# Altium schematic sheet TX_FlexiConnectors.SchDoc: Laser PCB
size A3; DrawnBy: James Singleton; Organization: TMC Technology Ltd.; DocumentNumber: 9; Revision: A; SheetNumber: 13; SheetTotal: 18; Drawn Date: 22/12/2020
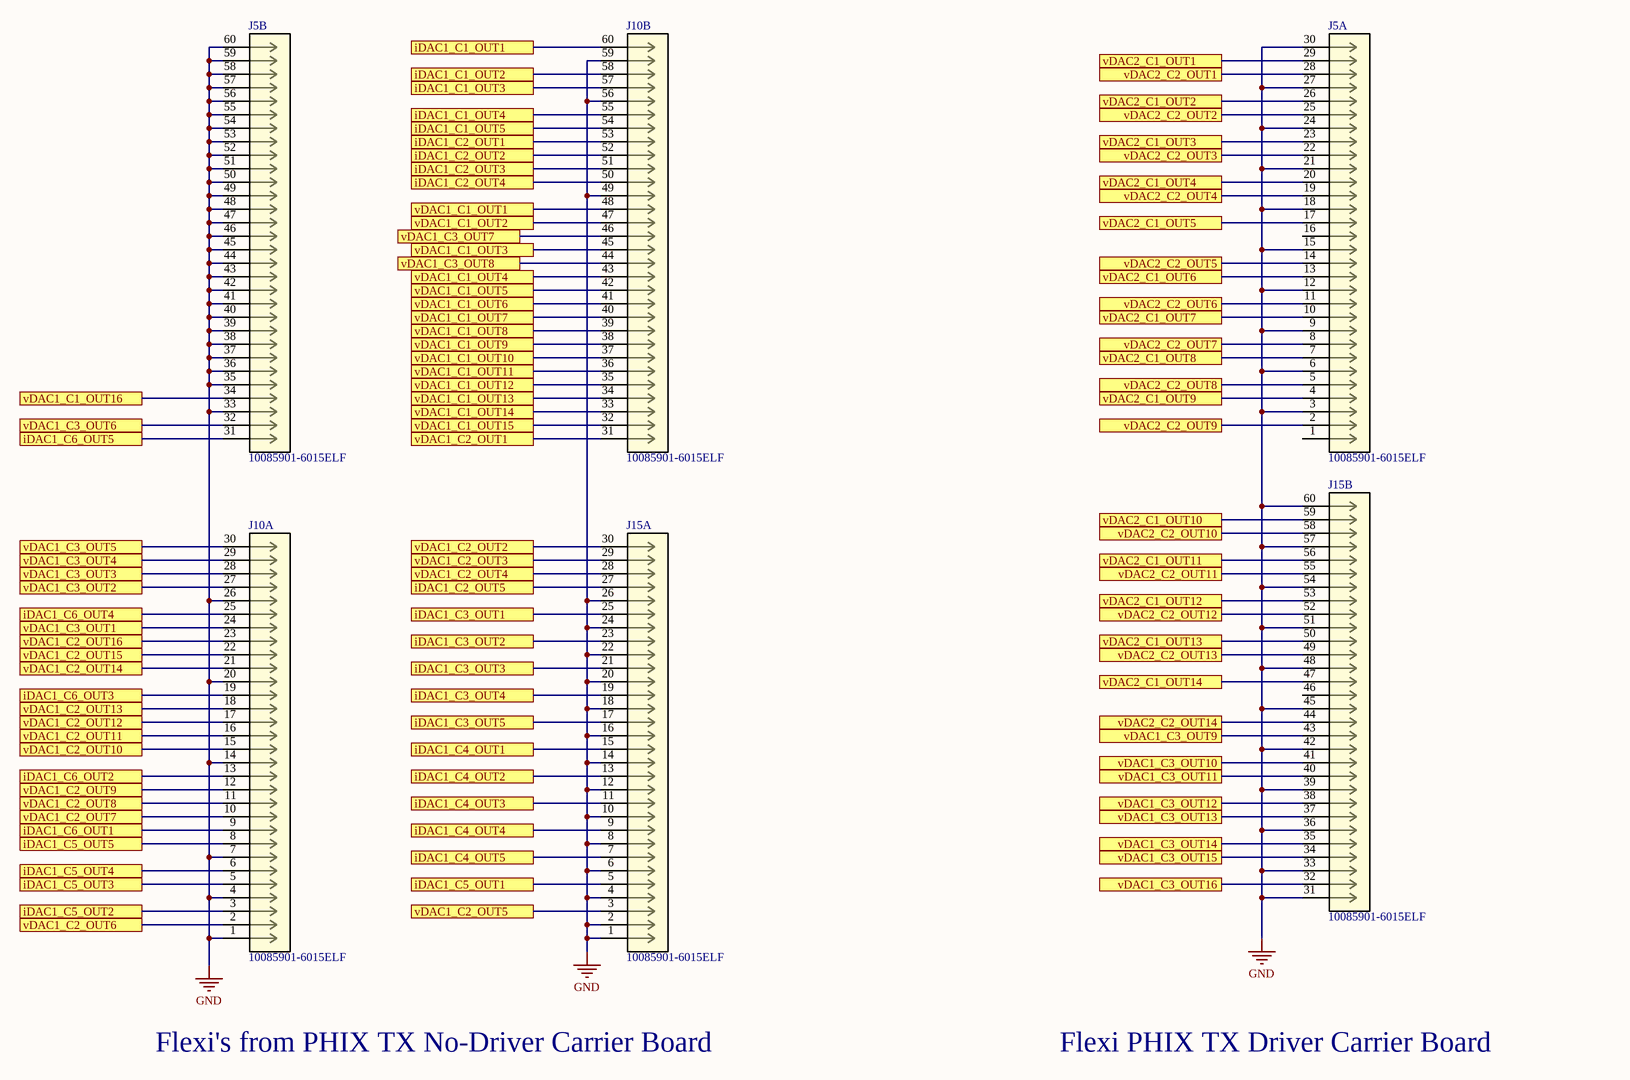
[diagram p0: TX_FlexiConnectors.SchDoc]

## Parts
J5  10085901-6015ELF  [CONN_10085901-6015ELF_AMP]  (parts A,B of 2)
J10  10085901-6015ELF  [CONN_10085901-6015ELF_AMP]  (parts A,B of 2)
J15  10085901-6015ELF  [CONN_10085901-6015ELF_AMP]  (parts A,B of 2)

## Ports
iDAC1_C1_OUT1 (see iDAC1[4A]), iDAC1_C1_OUT2 (see iDAC1[4A]), iDAC1_C1_OUT3 (see iDAC1[4A]), iDAC1_C1_OUT4 (see iDAC1[4A]), iDAC1_C1_OUT5 (see iDAC1[4A]), iDAC1_C2_OUT1 (see iDAC1[4A]), iDAC1_C2_OUT2 (see iDAC1[4A]), iDAC1_C2_OUT3 (see iDAC1[4A]), iDAC1_C2_OUT4 (see iDAC1[4A]), iDAC1_C2_OUT5 (see iDAC1[4A]), iDAC1_C3_OUT1 (see iDAC1[4B]), iDAC1_C3_OUT2 (see iDAC1[4B]), iDAC1_C3_OUT3 (see iDAC1[4B]), iDAC1_C3_OUT4 (see iDAC1[4B]), iDAC1_C3_OUT5 (see iDAC1[4B]), iDAC1_C4_OUT1 (see iDAC1[4B]), iDAC1_C4_OUT2 (see iDAC1[4B]), iDAC1_C4_OUT3 (see iDAC1[4B]), iDAC1_C4_OUT4 (see iDAC1[4B]), iDAC1_C4_OUT5 (see iDAC1[4B]), iDAC1_C5_OUT1 (see iDAC1[4C]), iDAC1_C5_OUT2 (see iDAC1[4C]), iDAC1_C5_OUT3 (see iDAC1[4C]), iDAC1_C5_OUT4 (see iDAC1[4C]), iDAC1_C5_OUT5 (see iDAC1[4C]), iDAC1_C6_OUT1 (see iDAC1[6A]), iDAC1_C6_OUT2 (see iDAC1[6A]), iDAC1_C6_OUT3 (see iDAC1[6A]), iDAC1_C6_OUT4 (see iDAC1[6A]), iDAC1_C6_OUT5 (see iDAC1[6A]), vDAC1_C1_OUT1 (see vDAC1[3A]), vDAC1_C1_OUT2 (see vDAC1[3B]), vDAC1_C1_OUT3 (see vDAC1[3B]), vDAC1_C1_OUT4 (see vDAC1[3B]), vDAC1_C1_OUT5 (see vDAC1[3B]), vDAC1_C1_OUT6 (see vDAC1[3B]), vDAC1_C1_OUT7 (see vDAC1[3B]), vDAC1_C1_OUT8 (see vDAC1[3B]), vDAC1_C1_OUT9 (see vDAC1[3B]), vDAC1_C1_OUT10 (see vDAC1[3B]), vDAC1_C1_OUT11 (see vDAC1[3B]), vDAC1_C1_OUT12 (see vDAC1[3B]), vDAC1_C1_OUT13 (see vDAC1[3B]), vDAC1_C1_OUT14 (see vDAC1[3B]), vDAC1_C1_OUT15 (see vDAC1[3B], vDAC1[5D]), vDAC1_C1_OUT16 (see vDAC1[3B], vDAC1[5D]), vDAC1_C2_OUT1 (see vDAC1[5A]), vDAC1_C2_OUT2 (see vDAC1[5B]), vDAC1_C2_OUT3 (see vDAC1[5B]), vDAC1_C2_OUT4 (see vDAC1[5B]), vDAC1_C2_OUT5 (see vDAC1[5B]), vDAC1_C2_OUT6 (see vDAC1[5B]), vDAC1_C2_OUT7 (see vDAC1[5B]), vDAC1_C2_OUT8 (see vDAC1[5B]), vDAC1_C2_OUT9 (see vDAC1[5B]), vDAC1_C2_OUT10 (see vDAC1[5B]), vDAC1_C2_OUT11 (see vDAC1[5B]), vDAC1_C2_OUT12 (see vDAC1[5B]), vDAC1_C2_OUT13 (see vDAC1[5B]), vDAC1_C2_OUT14 (see vDAC1[5B]), vDAC1_C2_OUT15 (see vDAC1[5B]), vDAC1_C2_OUT16 (see vDAC1[5B]), vDAC1_C3_OUT1 (see vDAC1[3C]), vDAC1_C3_OUT2 (see vDAC1[3C]), vDAC1_C3_OUT3 (see vDAC1[3C]), vDAC1_C3_OUT4 (see vDAC1[3C]), vDAC1_C3_OUT5 (see vDAC1[3C]), vDAC1_C3_OUT6 (see vDAC1[5C]), vDAC1_C3_OUT7 (see vDAC1[5C]), vDAC1_C3_OUT8 (see vDAC1[5C]), vDAC1_C3_OUT9 (see vDAC1[5C]), vDAC1_C3_OUT10 (see vDAC1[5C]), vDAC1_C3_OUT11 (see vDAC1[5C]), vDAC1_C3_OUT12 (see vDAC1[5C]), vDAC1_C3_OUT13 (see vDAC1[5C]), vDAC1_C3_OUT14 (see vDAC1[5C]), vDAC1_C3_OUT15 (see vDAC1[5C]), vDAC1_C3_OUT16 (see vDAC1[5C]), vDAC2_C1_OUT1 (see vDAC2[3A]), vDAC2_C1_OUT2 (see vDAC2[3B]), vDAC2_C1_OUT3 (see vDAC2[3B]), vDAC2_C1_OUT4 (see vDAC2[3B]), vDAC2_C1_OUT5 (see vDAC2[3B]), vDAC2_C1_OUT6 (see vDAC2[3B]), vDAC2_C1_OUT7 (see vDAC2[3B]), vDAC2_C1_OUT8 (see vDAC2[3B]), vDAC2_C1_OUT9 (see vDAC2[3B]), vDAC2_C1_OUT10 (see vDAC2[3B]), vDAC2_C1_OUT11 (see vDAC2[3B]), vDAC2_C1_OUT12 (see vDAC2[3B]), vDAC2_C1_OUT13 (see vDAC2[3B]), vDAC2_C1_OUT14 (see vDAC2[3B]), vDAC2_C2_OUT1 (see vDAC2[5A]), vDAC2_C2_OUT2 (see vDAC2[5B]), vDAC2_C2_OUT3 (see vDAC2[5B]), vDAC2_C2_OUT4 (see vDAC2[5B]), vDAC2_C2_OUT5 (see vDAC2[5B]), vDAC2_C2_OUT6 (see vDAC2[5B]), vDAC2_C2_OUT7 (see vDAC2[5B]), vDAC2_C2_OUT8 (see vDAC2[5B]), vDAC2_C2_OUT9 (see vDAC2[5B]), vDAC2_C2_OUT10 (see vDAC2[5B]), vDAC2_C2_OUT11 (see vDAC2[5B]), vDAC2_C2_OUT12 (see vDAC2[5B]), vDAC2_C2_OUT13 (see vDAC2[5B]), vDAC2_C2_OUT14 (see vDAC2[5B])

## Nets
GND: J5.3 J5.6 J5.9 J5.12 J5.15 J5.18 J5.21 J5.24 J5.27 J5.30 J5.33 J5.35 J5.36 J5.37 J5.38 J5.39 J5.40 J5.41 J5.42 J5.43 J5.44 J5.45 J5.46 J5.47 J5.48 J5.49 J5.50 J5.51 J5.52 J5.53 J5.54 J5.55 J5.56 J5.57 J5.58 J5.59 J5.60 J10.1 J10.4 J10.7 J10.14 J10.20 J10.26 J10.49 J10.56 J10.59 J15.1 J15.2 J15.4 J15.6 J15.8 J15.10 J15.12 J15.14 J15.16 J15.18 J15.20 J15.22 J15.24 J15.26 J15.31 J15.33 J15.36 J15.39 J15.42 J15.45 J15.48 J15.51 J15.54 J15.57 J15.60
iDAC1_C1_OUT1: J10.60 ; port iDAC1_C1_OUT1
iDAC1_C1_OUT2: J10.58 ; port iDAC1_C1_OUT2
iDAC1_C1_OUT3: J10.57 ; port iDAC1_C1_OUT3
iDAC1_C1_OUT4: J10.55 ; port iDAC1_C1_OUT4
iDAC1_C1_OUT5: J10.54 ; port iDAC1_C1_OUT5
iDAC1_C2_OUT1: J10.53 ; port iDAC1_C2_OUT1
iDAC1_C2_OUT2: J10.52 ; port iDAC1_C2_OUT2
iDAC1_C2_OUT3: J10.51 ; port iDAC1_C2_OUT3
iDAC1_C2_OUT4: J10.50 ; port iDAC1_C2_OUT4
iDAC1_C2_OUT5: J15.27 ; port iDAC1_C2_OUT5
iDAC1_C3_OUT1: J15.25 ; port iDAC1_C3_OUT1
iDAC1_C3_OUT2: J15.23 ; port iDAC1_C3_OUT2
iDAC1_C3_OUT3: J15.21 ; port iDAC1_C3_OUT3
iDAC1_C3_OUT4: J15.19 ; port iDAC1_C3_OUT4
iDAC1_C3_OUT5: J15.17 ; port iDAC1_C3_OUT5
iDAC1_C4_OUT1: J15.15 ; port iDAC1_C4_OUT1
iDAC1_C4_OUT2: J15.13 ; port iDAC1_C4_OUT2
iDAC1_C4_OUT3: J15.11 ; port iDAC1_C4_OUT3
iDAC1_C4_OUT4: J15.9 ; port iDAC1_C4_OUT4
iDAC1_C4_OUT5: J15.7 ; port iDAC1_C4_OUT5
iDAC1_C5_OUT1: J15.5 ; port iDAC1_C5_OUT1
iDAC1_C5_OUT2: J10.3 ; port iDAC1_C5_OUT2
iDAC1_C5_OUT3: J10.5 ; port iDAC1_C5_OUT3
iDAC1_C5_OUT4: J10.6 ; port iDAC1_C5_OUT4
iDAC1_C5_OUT5: J10.8 ; port iDAC1_C5_OUT5
iDAC1_C6_OUT1: J10.9 ; port iDAC1_C6_OUT1
iDAC1_C6_OUT2: J10.13 ; port iDAC1_C6_OUT2
iDAC1_C6_OUT3: J10.19 ; port iDAC1_C6_OUT3
iDAC1_C6_OUT4: J10.25 ; port iDAC1_C6_OUT4
iDAC1_C6_OUT5: J5.31 ; port iDAC1_C6_OUT5
vDAC1_C1_OUT1: J10.48 ; port vDAC1_C1_OUT1
vDAC1_C1_OUT2: J10.47 ; port vDAC1_C1_OUT2
vDAC1_C1_OUT3: J10.45 ; port vDAC1_C1_OUT3
vDAC1_C1_OUT4: J10.43 ; port vDAC1_C1_OUT4
vDAC1_C1_OUT5: J10.42 ; port vDAC1_C1_OUT5
vDAC1_C1_OUT6: J10.41 ; port vDAC1_C1_OUT6
vDAC1_C1_OUT7: J10.40 ; port vDAC1_C1_OUT7
vDAC1_C1_OUT8: J10.39 ; port vDAC1_C1_OUT8
vDAC1_C1_OUT9: J10.38 ; port vDAC1_C1_OUT9
vDAC1_C1_OUT10: J10.37 ; port vDAC1_C1_OUT10
vDAC1_C1_OUT11: J10.36 ; port vDAC1_C1_OUT11
vDAC1_C1_OUT12: J10.35 ; port vDAC1_C1_OUT12
vDAC1_C1_OUT13: J10.34 ; port vDAC1_C1_OUT13
vDAC1_C1_OUT14: J10.33 ; port vDAC1_C1_OUT14
vDAC1_C1_OUT15: J10.32 ; port vDAC1_C1_OUT15
vDAC1_C1_OUT16: J5.34 ; port vDAC1_C1_OUT16
vDAC1_C2_OUT1: J10.31 ; port vDAC1_C2_OUT1
vDAC1_C2_OUT2: J15.30 ; port vDAC1_C2_OUT2
vDAC1_C2_OUT3: J15.29 ; port vDAC1_C2_OUT3
vDAC1_C2_OUT4: J15.28 ; port vDAC1_C2_OUT4
vDAC1_C2_OUT5: J15.3 ; port vDAC1_C2_OUT5
vDAC1_C2_OUT6: J10.2 ; port vDAC1_C2_OUT6
vDAC1_C2_OUT7: J10.10 ; port vDAC1_C2_OUT7
vDAC1_C2_OUT8: J10.11 ; port vDAC1_C2_OUT8
vDAC1_C2_OUT9: J10.12 ; port vDAC1_C2_OUT9
vDAC1_C2_OUT10: J10.15 ; port vDAC1_C2_OUT10
vDAC1_C2_OUT11: J10.16 ; port vDAC1_C2_OUT11
vDAC1_C2_OUT12: J10.17 ; port vDAC1_C2_OUT12
vDAC1_C2_OUT13: J10.18 ; port vDAC1_C2_OUT13
vDAC1_C2_OUT14: J10.21 ; port vDAC1_C2_OUT14
vDAC1_C2_OUT15: J10.22 ; port vDAC1_C2_OUT15
vDAC1_C2_OUT16: J10.23 ; port vDAC1_C2_OUT16
vDAC1_C3_OUT1: J10.24 ; port vDAC1_C3_OUT1
vDAC1_C3_OUT2: J10.27 ; port vDAC1_C3_OUT2
vDAC1_C3_OUT3: J10.28 ; port vDAC1_C3_OUT3
vDAC1_C3_OUT4: J10.29 ; port vDAC1_C3_OUT4
vDAC1_C3_OUT5: J10.30 ; port vDAC1_C3_OUT5
vDAC1_C3_OUT6: J5.32 ; port vDAC1_C3_OUT6
vDAC1_C3_OUT7: J10.46 ; port vDAC1_C3_OUT7
vDAC1_C3_OUT8: J10.44 ; port vDAC1_C3_OUT8
vDAC1_C3_OUT9: J15.43 ; port vDAC1_C3_OUT9
vDAC1_C3_OUT10: J15.41 ; port vDAC1_C3_OUT10
vDAC1_C3_OUT11: J15.40 ; port vDAC1_C3_OUT11
vDAC1_C3_OUT12: J15.38 ; port vDAC1_C3_OUT12
vDAC1_C3_OUT13: J15.37 ; port vDAC1_C3_OUT13
vDAC1_C3_OUT14: J15.35 ; port vDAC1_C3_OUT14
vDAC1_C3_OUT15: J15.34 ; port vDAC1_C3_OUT15
vDAC1_C3_OUT16: J15.32 ; port vDAC1_C3_OUT16
vDAC2_C1_OUT1: J5.29 ; port vDAC2_C1_OUT1
vDAC2_C1_OUT2: J5.26 ; port vDAC2_C1_OUT2
vDAC2_C1_OUT3: J5.23 ; port vDAC2_C1_OUT3
vDAC2_C1_OUT4: J5.20 ; port vDAC2_C1_OUT4
vDAC2_C1_OUT5: J5.17 ; port vDAC2_C1_OUT5
vDAC2_C1_OUT6: J5.13 ; port vDAC2_C1_OUT6
vDAC2_C1_OUT7: J5.10 ; port vDAC2_C1_OUT7
vDAC2_C1_OUT8: J5.7 ; port vDAC2_C1_OUT8
vDAC2_C1_OUT9: J5.4 ; port vDAC2_C1_OUT9
vDAC2_C1_OUT10: J15.59 ; port vDAC2_C1_OUT10
vDAC2_C1_OUT11: J15.56 ; port vDAC2_C1_OUT11
vDAC2_C1_OUT12: J15.53 ; port vDAC2_C1_OUT12
vDAC2_C1_OUT13: J15.50 ; port vDAC2_C1_OUT13
vDAC2_C1_OUT14: J15.47 ; port vDAC2_C1_OUT14
vDAC2_C2_OUT1: J5.28 ; port vDAC2_C2_OUT1
vDAC2_C2_OUT2: J5.25 ; port vDAC2_C2_OUT2
vDAC2_C2_OUT3: J5.22 ; port vDAC2_C2_OUT3
vDAC2_C2_OUT4: J5.19 ; port vDAC2_C2_OUT4
vDAC2_C2_OUT5: J5.14 ; port vDAC2_C2_OUT5
vDAC2_C2_OUT6: J5.11 ; port vDAC2_C2_OUT6
vDAC2_C2_OUT7: J5.8 ; port vDAC2_C2_OUT7
vDAC2_C2_OUT8: J5.5 ; port vDAC2_C2_OUT8
vDAC2_C2_OUT9: J5.2 ; port vDAC2_C2_OUT9
vDAC2_C2_OUT10: J15.58 ; port vDAC2_C2_OUT10
vDAC2_C2_OUT11: J15.55 ; port vDAC2_C2_OUT11
vDAC2_C2_OUT12: J15.52 ; port vDAC2_C2_OUT12
vDAC2_C2_OUT13: J15.49 ; port vDAC2_C2_OUT13
vDAC2_C2_OUT14: J15.44 ; port vDAC2_C2_OUT14

Not connected (* = marked no-connect by the designer): J5 1 16; J15 46

## Notes on the sheet
- Flexi's from PHIX TX No-Driver Carrier Board
- Flexi PHIX TX Driver Carrier Board
- TMC Technology Ltd.
- Page Contents:
- Project:
- Variant:
- Checked By:
- Size:
- Date:
- Dwg No:
- Sheet
- of
- Revision:

## Library data of the parts
J5 J10 J15 = 10085901-6015ELF: No Description Available; Vendor: Amphenol; Built_By: EMA_Cory; SourceLibrary: Add_to_database_2021-04-09; System: Connector; Datasheet: https://cdn.amphenol-icc.com/media/wysiwyg/files/drawing/10085901.pdf?__cf_chl_jschl_tk__=00cf1f2338c5aeb40a4a47e00234174ceeaf26be-1617915708-0-AUipvdsWCe-XZcdQlp4wT1nonxNIPUZLiwIArEoPaP6cuSg2Amwfh3IakaG5lV7f92VjraYq1c-sb0kWBpxlvqJ5btwK7xgzNsdYdPmM7_nb70OsPjyWttq9HPXjGplazXSr1hDHv_rDyC0zqv3HN48lPyOnNuBENjkL6MLTjp3uNt_7zdD9wXF42vBbOCWCMT21rEgRTcG02oyZPRtIZwSo4Bm14CHkq-wdTg3hTL-ge00hJNPLNIP2JOl_bFxROehCM3O6jFy1LURflg9URMEHmwnyPbKOGS5_efv-ux4kMXut2MrrVkPCOaNyQI6A4DXSEQB6NjyE-YiRBZyhp3AdQLNym8hlKD61FdGHWwHwPR-a6VgqUZ92M4HgAmiZit1aB5L5iBGO44LNzjKKX60f2YBLURA21HBfVl5evVMz2Eb-ABe8B7xej-rMAyqLj9p7F-6ASMxfQEpk_K_En3gheYDfZcXem0ttM-lU-86L; Manufacturer_Part_Number: 10085901-6015ELF; Copyright: Copyright (C) 2018 Accelerated Designs. All rights reserved; RefDes: RefDes; Type: DEV